# Altium schematic sheet Module Board.SchDoc: Module Board
size A3; Author: Arjan Blankestijn; Revision: V1; SheetNumber: 1; SheetTotal: 2; Team: 2024; Subsystem: Module Board; ProjectPrettyName: BMS
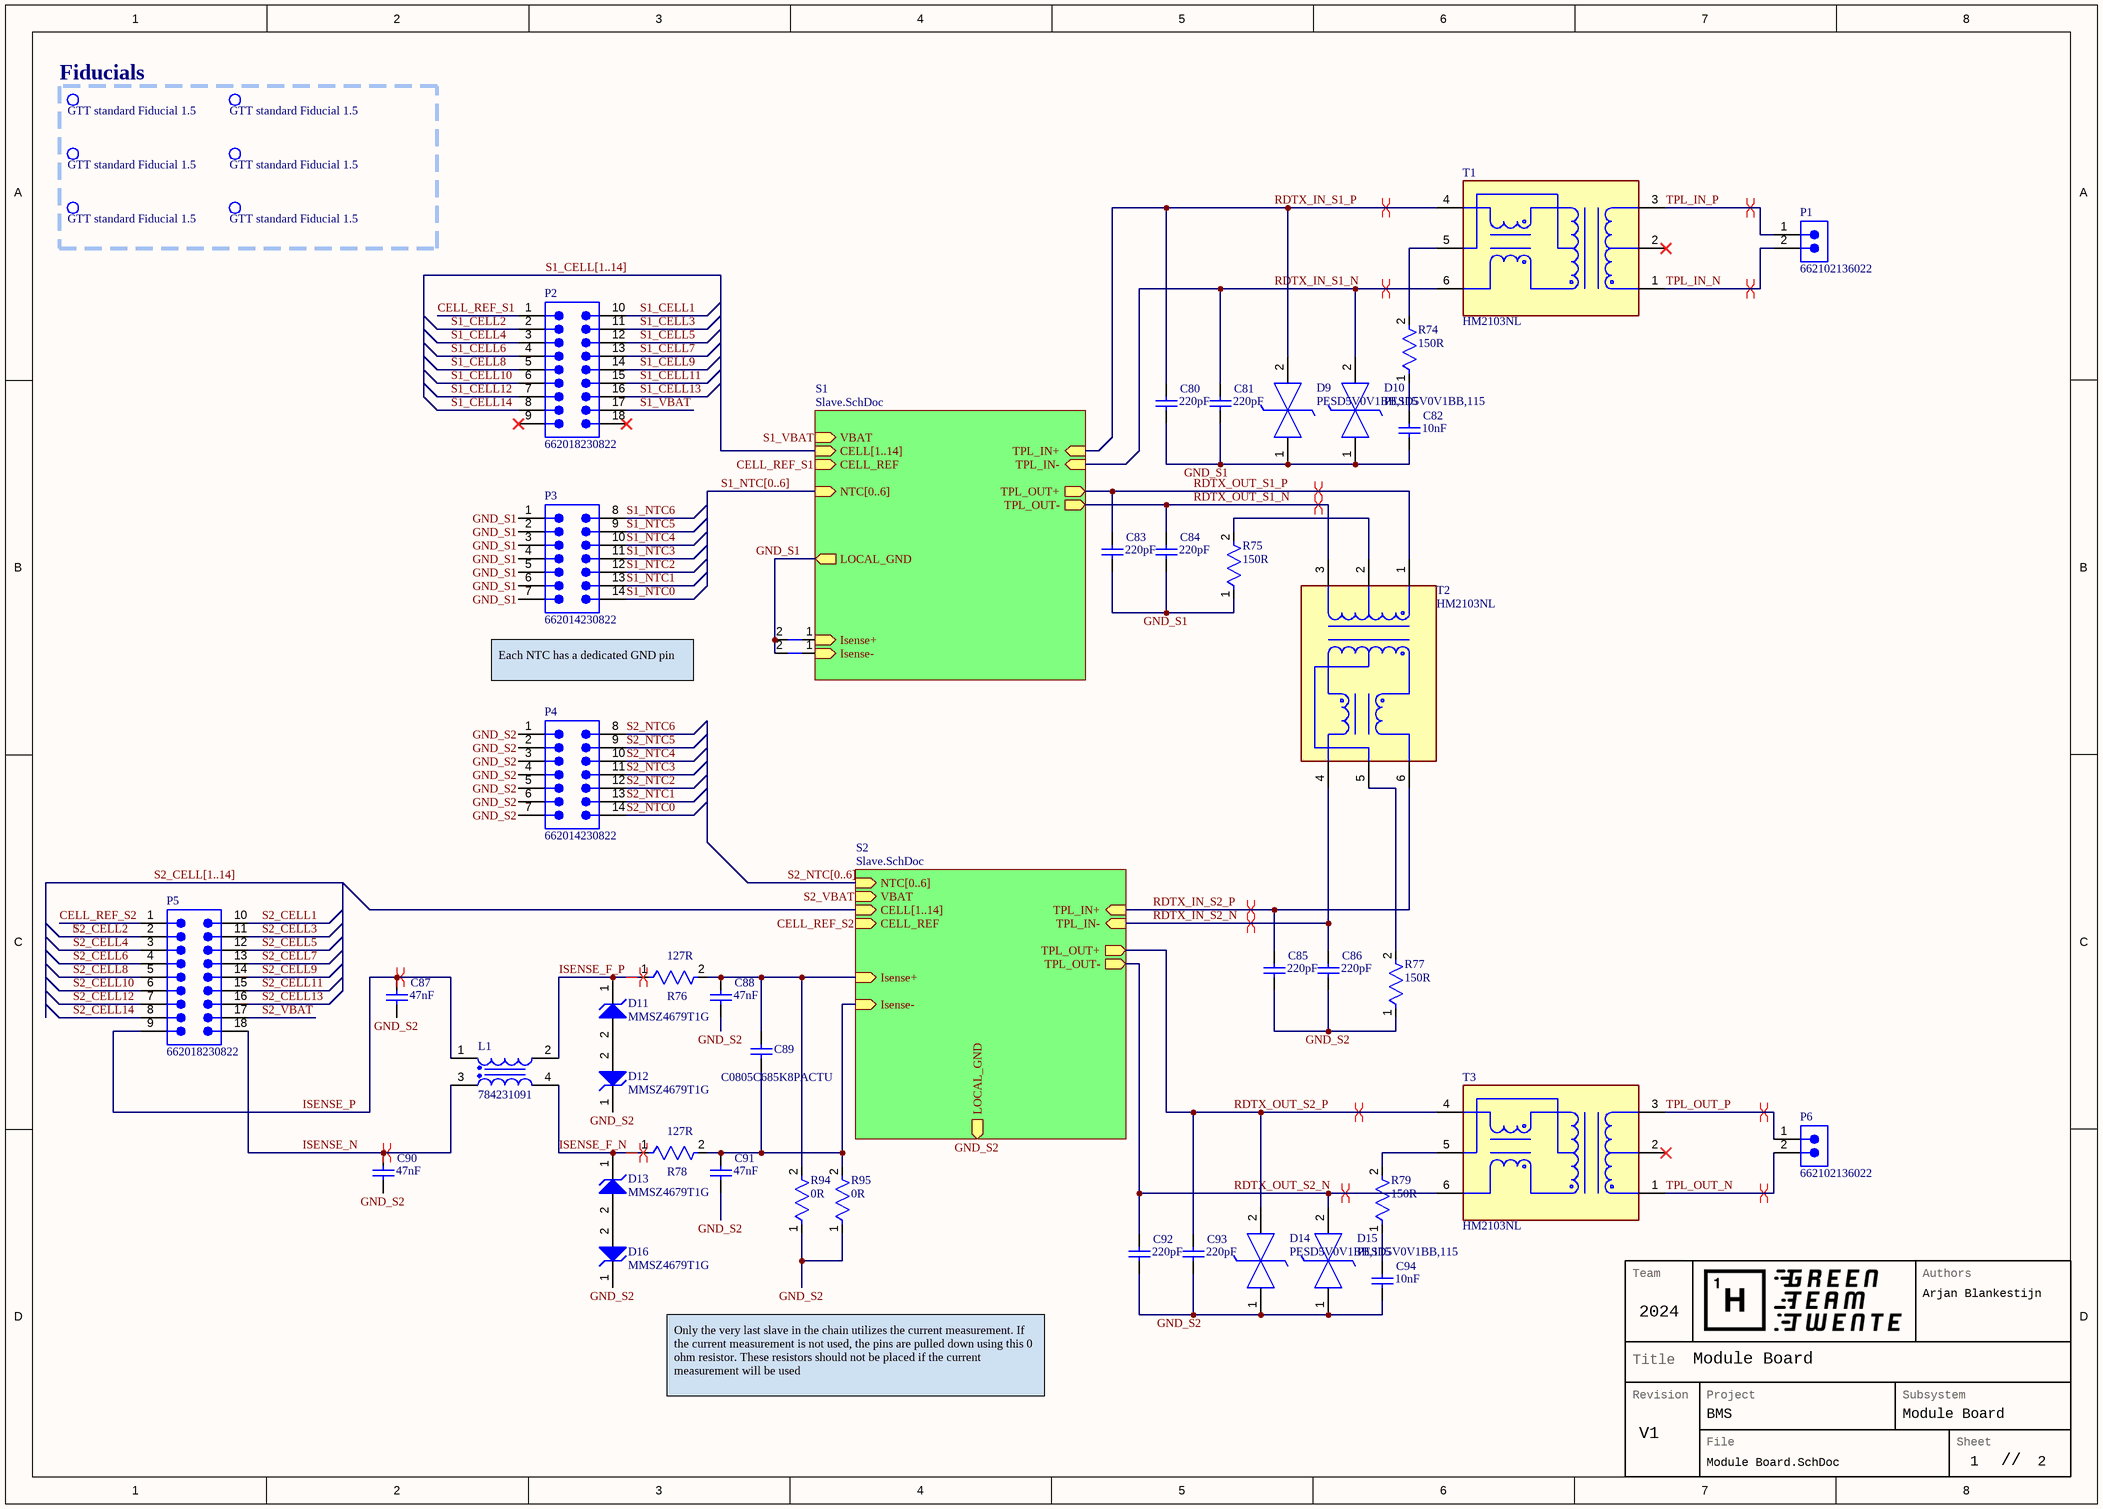
[diagram p0: Module Board.SchDoc]

## Parts
*1  GTT standard Fiducial 1.5  [Fiducial 1.5mm]  (no BOM)
*2  GTT standard Fiducial 1.5  [Fiducial 1.5mm]  (no BOM)
*3  GTT standard Fiducial 1.5  [Fiducial 1.5mm]  (no BOM)
*4  GTT standard Fiducial 1.5  [Fiducial 1.5mm]  (no BOM)
*5  GTT standard Fiducial 1.5  [Fiducial 1.5mm]  (no BOM)
*6  GTT standard Fiducial 1.5  [Fiducial 1.5mm]  (no BOM)
C80  value 220pF  [WCAP-CSGP_0402_L1W0.5H0.5]  (hidden comment: CAP 0402 220pF X7R)
C81  value 220pF  [WCAP-CSGP_0402_L1W0.5H0.5]  (hidden comment: CAP 0402 220pF X7R)
C82  value 10nF  [WCAP-CSGP_0402_L1W0.5H0.5]  (hidden comment: CAP 0402 10nF X7R)
C83  value 220pF  [WCAP-CSGP_0402_L1W0.5H0.5]  (hidden comment: CAP 0402 220pF X7R)
C84  value 220pF  [WCAP-CSGP_0402_L1W0.5H0.5]  (hidden comment: CAP 0402 220pF X7R)
C85  value 220pF  [WCAP-CSGP_0402_L1W0.5H0.5]  (hidden comment: CAP 0402 220pF X7R)
C86  value 220pF  [WCAP-CSGP_0402_L1W0.5H0.5]  (hidden comment: CAP 0402 220pF X7R)
C87  value 47nF  [WCAP-CSGP_0402_L1W0.5H0.5]  (hidden comment: CAP 0402 47nF X7R)
C88  value 47nF  [WCAP-CSGP_0402_L1W0.5H0.5]  (hidden comment: CAP 0402 47nF X7R)
C89  C0805C685K8PACTU  [CAPC2013X145X50NL20T25]
C90  value 47nF  [WCAP-CSGP_0402_L1W0.5H0.5]  (hidden comment: CAP 0402 47nF X7R)
C91  value 47nF  [WCAP-CSGP_0402_L1W0.5H0.5]  (hidden comment: CAP 0402 47nF X7R)
C92  value 220pF  [WCAP-CSGP_0402_L1W0.5H0.5]  (hidden comment: CAP 0402 220pF X7R)
C93  value 220pF  [WCAP-CSGP_0402_L1W0.5H0.5]  (hidden comment: CAP 0402 220pF X7R)
C94  value 10nF  [WCAP-CSGP_0402_L1W0.5H0.5]  (hidden comment: CAP 0402 10nF X7R)
D9  PESD5V0V1BB,115  [PESD5V0V1BB115]
D10  PESD5V0V1BB,115  [PESD5V0V1BB115]
D11  MMSZ4679T1G  [ONSC-SOD-123-2-425-04_V]
D12  MMSZ4679T1G  [ONSC-SOD-123-2-425-04_V]
D13  MMSZ4679T1G  [ONSC-SOD-123-2-425-04_V]
D14  PESD5V0V1BB,115  [PESD5V0V1BB115]
D15  PESD5V0V1BB,115  [PESD5V0V1BB115]
D16  MMSZ4679T1G  [ONSC-SOD-123-2-425-04_V]
L1  784231091  [WE-CNSA_0805]
NT1  Net Tie 0.2mm  [NETTIE_0.2mm]  (value not drawn)  (net tie, no BOM)
NT2  Net Tie 0.2mm  [NETTIE_0.2mm]  (value not drawn)  (net tie, no BOM)
P1  662102136022  [662102136022]
P2  662018230822  [662018230822]
P3  662014230822  [662014230822]
P4  662014230822  [662014230822]
P5  662018230822  [662018230822]
P6  662102136022  [662102136022]
R74  value 150R  [FP0402]  (hidden comment: RES 0402 150R 1%)
R75  value 150R  [FP0402]  (hidden comment: RES 0402 150R 1%)
R76  value 127R  [FP0402]  (hidden comment: RES 0402 127R 1%)
R77  value 150R  [FP0402]  (hidden comment: RES 0402 150R 1%)
R78  value 127R  [FP0402]  (hidden comment: RES 0402 127R 1%)
R79  value 150R  [FP0402]  (hidden comment: RES 0402 150R 1%)
R94  value 0R  [FP0402]  (hidden comment: RES 0402 0R 1%)
R95  value 0R  [FP0402]  (hidden comment: RES 0402 0R 1%)
T1  HM2103NL  [FP-HM2103NL-MFG]
T2  HM2103NL  [FP-HM2103NL-MFG]
T3  HM2103NL  [FP-HM2103NL-MFG]

## Blocks framed on the sheet
Fiducials: *1-*6

## Sub-sheets
S1 = Slave.SchDoc: CELL[1..14] (in), CELL_REF (in), LOCAL_GND (out), NTC[0..6] (in), TPL_IN+ (in), TPL_IN- (in), TPL_OUT+ (out), TPL_OUT- (out), Isense+ (in), Isense- (in), VBAT (in)
S2 = Slave.SchDoc: CELL[1..14] (in), CELL_REF (in), LOCAL_GND (out), NTC[0..6] (in), TPL_IN+ (in), TPL_IN- (in), TPL_OUT+ (out), TPL_OUT- (out), Isense+ (in), Isense- (in), VBAT (in)

## Nets
: P5.2  [also labelled S2_CELL2]
CELL_REF_S1: P2.1 ; sheet S1/CELL_REF
CELL_REF_S2: P5.1 ; sheet S2/CELL_REF
GND_S1: C80.1 C81.1 C82.1 C83.1 C84.1 D9.1(K1) D10.1(K1) NT1.2 NT2.2 P3.1 P3.2 P3.3 P3.4 P3.5 P3.6 P3.7 R75.1 ; sheet S1/LOCAL_GND
GND_S2: C85.1 C86.1 C87.1 C88.1 C90.1 C91.1 C92.1 C93.1 C94.1 D12.1(K) D14.1(K1) D15.1(K1) D16.1(K) P4.1 P4.2 P4.3 P4.4 P4.5 P4.6 P4.7 R77.1 R94.1 R95.1 ; sheet S2/LOCAL_GND
ISENSE_F_N: D13.1(K) L1.4 R78.1
ISENSE_F_P: D11.1(K) L1.2 R76.1
ISENSE_N: C90.2 L1.3 P5.18
ISENSE_P: C87.2 L1.1 P5.9
RDTX_IN_S1_N: C81.2 D10.2(K2) T1.6 ; sheet S1/TPL_IN-
RDTX_IN_S1_P: C80.2 D9.2(K2) T1.4 ; sheet S1/TPL_IN+
RDTX_IN_S2_N: C86.2 T2.4 ; sheet S2/TPL_IN-
RDTX_IN_S2_P: C85.2 T2.6 ; sheet S2/TPL_IN+
RDTX_OUT_S1_N: C84.2 T2.3 ; sheet S1/TPL_OUT-
RDTX_OUT_S1_P: C83.2 T2.1 ; sheet S1/TPL_OUT+
RDTX_OUT_S2_N: C92.2 D15.2(K2) T3.6 ; sheet S2/TPL_OUT-
RDTX_OUT_S2_P: C93.2 D14.2(K2) T3.4 ; sheet S2/TPL_OUT+
S1_CELL1: P2.10
S1_CELL2: P2.2
S1_CELL3: P2.11
S1_CELL4: P2.3
S1_CELL5: P2.12
S1_CELL6: P2.4
S1_CELL7: P2.13
S1_CELL8: P2.5
S1_CELL9: P2.14
S1_CELL10: P2.6
S1_CELL11: P2.15
S1_CELL12: P2.7
S1_CELL13: P2.16
S1_CELL14: P2.8
S1_NTC0: P3.14
S1_NTC1: P3.13
S1_NTC2: P3.12
S1_NTC3: P3.11
S1_NTC4: P3.10
S1_NTC5: P3.9
S1_NTC6: P3.8
S1_VBAT: P2.17 ; sheet S1/VBAT
S2_CELL1: P5.10
S2_CELL3: P5.11
S2_CELL4: P5.3
S2_CELL5: P5.12
S2_CELL6: P5.4
S2_CELL7: P5.13
S2_CELL8: P5.5
S2_CELL9: P5.14
S2_CELL10: P5.6
S2_CELL11: P5.15
S2_CELL12: P5.7
S2_CELL13: P5.16
S2_CELL14: P5.8
S2_NTC0: P4.14
S2_NTC1: P4.13
S2_NTC2: P4.12
S2_NTC3: P4.11
S2_NTC4: P4.10
S2_NTC5: P4.9
S2_NTC6: P4.8
S2_VBAT: P5.17 ; sheet S2/VBAT
TPL_IN_N: P1.2 T1.1
TPL_IN_P: P1.1 T1.3
TPL_OUT_N: P6.2 T3.1
TPL_OUT_P: P6.1 T3.3
NetC82_2: C82.2 R74.1
NetC88_2: C88.2 C89.2 R76.2 R94.2 ; sheet S2/Isense+
NetC89_1: C89.1 C91.2 R78.2 R95.2 ; sheet S2/Isense-
NetC94_2: C94.2 R79.1
NetD11_2: D11.2(A) D12.2(A)
NetD13_2: D13.2(A) D16.2(A)
NetNT1_1: NT1.1 ; sheet S1/Isense+
NetNT2_1: NT2.1 ; sheet S1/Isense-
NetR74_2: R74.2 T1.5
NetR75_2: R75.2 T2.2
NetR77_2: R77.2 T2.5
NetR79_2: R79.2 T3.5

Not connected (* = marked no-connect by the designer): P2 9* 18*; T1 2*; T3 2*

## Buses and harness runs
bus S1_CELL[1..14] = sheet S1/CELL[1..14]
bus S1_NTC[0..6] = sheet S1/NTC[0..6]
bus S2_CELL[1..14] = sheet S2/CELL[1..14]
bus S2_NTC[0..6] = sheet S2/NTC[0..6]

## Layout directives
differential pair; differential pair class TPL100; rule Clearance Constraint [Generic clearance = 0.15mm, and 12 value(s) for objects]: RDTX_IN_S1_N, RDTX_IN_S1_P, RDTX_IN_S2_N, RDTX_IN_S2_P, RDTX_OUT_S1_N, RDTX_OUT_S1_P, RDTX_OUT_S2_N, RDTX_OUT_S2_P, TPL_IN_N, TPL_IN_P, TPL_OUT_N, TPL_OUT_P
differential pair: ISENSE_F_N, ISENSE_F_P, ISENSE_N, ISENSE_P

## Notes on the sheet
- Each NTC has a dedicated GND pin
- Only the very last slave in the chain utilizes the current measurement. If the current measurement is not used, the pins are pulled down using this 0 ohm resistor. These resistors should not be placed if the current measurement will be used
- Team
- Authors
- Revision
- Title
- Project
- Subsystem
- File
- Sheet
- //

## Library data of the parts
*1-*6 = CMP-00028-00005-4: Fiducial 1.5; Pins: 0
C80-C88 C90-C94 = CMP-001-01308-5: GTT Standard 0402 non-polarized capacitor; Pins: 2; Case/Package: 0402; Category: Multilayer Ceramic Chip Capacitors; Ceramic Type: X7R
C89 = CMP-1036-04909-2: 6.8uF 0804; Manufacturer: Kemet; Part Number: C0805C685K8PACTU
D9 D10 D14 D15 = CMP-004-00097-1: PESD5V0V1BB - Very low capacitance bidirectional ESD protection diode; Manufacturer_Name: Nexperia; Arrow Price/Stock: https://www.arrow.com/en/products/pesd5v0v1bb115/nexperia?region=nac; Design Item ID: PESD5V0V1BB,115; Height: 0.65mm; Manufacturer_Part_Number: PESD5V0V1BB,115; Mouser Price/Stock: https://www.mouser.co.uk/ProductDetail/Nexperia/PESD5V0V1BB115?qs=GcY6OjH1zdkfLKV5vNnV%252BA%3D%3D; Datasheet Link: https://assets.nexperia.com/documents/data-sheet/PESD5V0V1BB.pdf; Mouser Part Number: 771-PESD5V0V1BB115; Source: TempSchematics.schlib; Arrow Part Number: PESD5V0V1BB,115
D11-D13 D16 = CMP-1060-00509-1: Zener Voltage Regulator, 500 mW, 2-Pin SOD-123, Pb-Free, Tape and Reel; Manufacturer: On Semiconductor; P Max (W): 0.5; VZ Typ (V): 2; Packing: Tape and Reel; ComponentLink1Description: Manufacturer URL; DatasheetVersion: Rev. 9; PackageReference: SOD-123-2-425-04; ComponentLink3URL: http://www.onsemi.com/pub_link/Collateral/425-04.PDF; PackageDescription: 2-Pin SOD, Body 1.6 x 2.69 mm; ComponentLink3Description: Package Specification; ComponentLink2Description: Datasheet; ComponentLink1URL: http://www.onsemi.com/; PartNumber: MMSZ4679T1G; RoHS: Pb-Free; PackageVersion: Rev. G, 10/2009; ComponentLink2URL: http://www.onsemi.com/pub_link/Collateral/MMSZ4678T1-D.PDF; Mounting Technology: Surface Mount
L1 = CMP-00030-00004-1: Common Mode Filter, Aec-Q200, 131Nh/0.37A Rohs Compliant: Yes
NT1 NT2 = CMP-009-00202-2
P1 P6 = CMP-1502-00472-2: NexarPartId: 71472447; Operating Supply Voltage: 250V; Insulation Resistance: 1GΩ; Contact Resistance: 10mΩ; Number of Positions: 2; Pitch: 3mm; Gender: Male; Connector Type: Male Pin; Current Rating: 5A; Lead Pitch: 3mm; Number of Pins: 2; Fastening Type: Ramp; Color: Black; Packaging: Tape and Reel; Mount: Surface Mount; Length: 9.65mm; Contact Plating: Tin; Max Operating Temperature: 105°C; RoHS: Compliant; Min Operating Temperature: -40°C; Number of Rows: 1; Termination: Solder
P2 P5 = CMP-1502-00404-2: NexarPartId: 23024748; Contact Resistance: 10mΩ; Pitch: 3mm; Number of Positions: 18; Insulation Resistance: 1GΩ; Gender: Male; Connector Type: Male Pin, Socket; Operating Supply Voltage: 250V; Current Rating: 5A; Row Spacing: 2.9972mm; RoHS: Compliant; Color: Black; Height: 11.36mm; REACH SVHC: Unknown; Contact Plating: Tin; Contact Material: Copper; Width: 30.7mm; Length: 30.7mm; Mount: Surface Mount; Termination: Solder; Max Operating Temperature: 105°C; Number of Pins: 18; Min Operating Temperature: -40°C; Lead Pitch: 3mm; Fastening Type: Ramp; Number of Rows: 2; Number of Contacts: 18
P3 P4 = CMP-1502-00402-2: NexarPartId: 23024730; Contact Resistance: 10mΩ; Connector Type: Male Pin, Socket; Gender: Male; Number of Contacts: 14; Operating Supply Voltage: 250V; Current Rating: 5A; Insulation Resistance: 1GΩ; Pitch: 3mm; Row Spacing: 2.9972mm; Height: 11.36mm; Color: Black; Contact Plating: Tin; Lead Pitch: 3mm; Number of Positions: 14; Number of Rows: 2; Min Operating Temperature: -40°C; Contact Material: Copper; Termination: Solder; REACH SVHC: Unknown; Number of Pins: 14; Max Operating Temperature: 105°C; Mount: Surface Mount; RoHS: Compliant; Fastening Type: Ramp; Length: 24.7mm; Width: 24.7mm
R74-R79 R94 R95 = CMP-009-00204-16: GTT Standard 0402 Resistor; Voltage Rating: 50V; Power: 62.5mW; Case/Package: 0402; Mounting Technology: SMD; Design Item ID: RES 0402; Source: Passives.SchLib; Tolerance: 1%
T1-T3 = CMP-16309-000039-1: XFMR CMC MODULE AECQ BATT MNGT; Obsolete Part: false; Manufacturer: Pulse; Isolation Voltage: 4300VDC; Automotive Grade: Grade 1; Turns Ratio: 1:1; Standoff Height: 0.13mm; Insertion Loss: 0.25dB; Return Loss: 20dB; Inductance Primary: 150uH; Device Class L2: Transformers; Automotive: Yes; RoHS: TRUE; Device Class L1: Passive Components; Digikey Description: XFMR CMC MODULE AECQ BATT MNGT; Package: 0; Manufacturer Part Number: HM2103NL; Height: 5.72mm; Temperature Range High: +125°C; Temperature Range Low: -40°C; Category: Trans; Temperature: -40°C to +125°C; Lead Free: Yes; ComponentLink2URL: https://productfinder.pulseeng.com/product/HM2103NL; Octopart: https://octopart.com/hm2103nl-pulse-87646222; Device Class L3: unset; ComponentLink2Description: Datasheet